# Altium schematic sheet Power Budget.SchDoc
size A; SheetNumber: 2; SheetTotal: 2
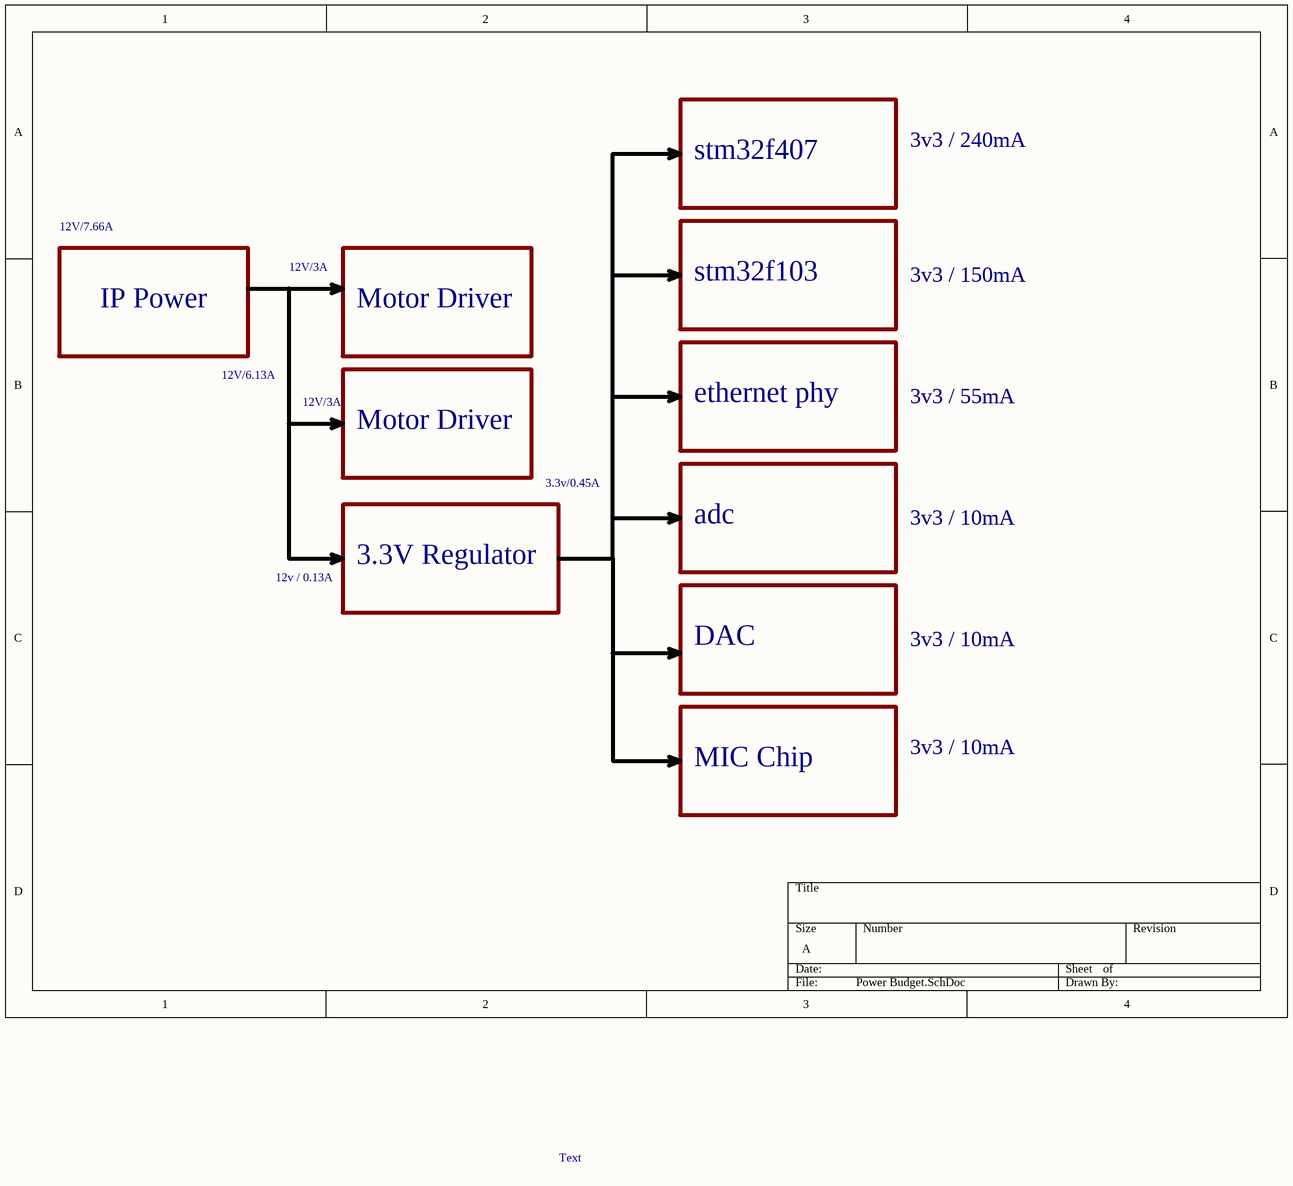
[diagram p0: Power Budget.SchDoc]

## Notes on the sheet
- stm32f407
- 3v3 / 240mA
- 12V/7.66A
- 12V/3A
- stm32f103
- 3v3 / 150mA
- IP Power
- Motor Driver
- 12V/6.13A
- ethernet phy
- 3v3 / 55mA
- 3.3v/0.45A
- 3.3V Regulator
- adc
- 3v3 / 10mA
- 12v / 0.13A
- DAC
- MIC Chip
- Text